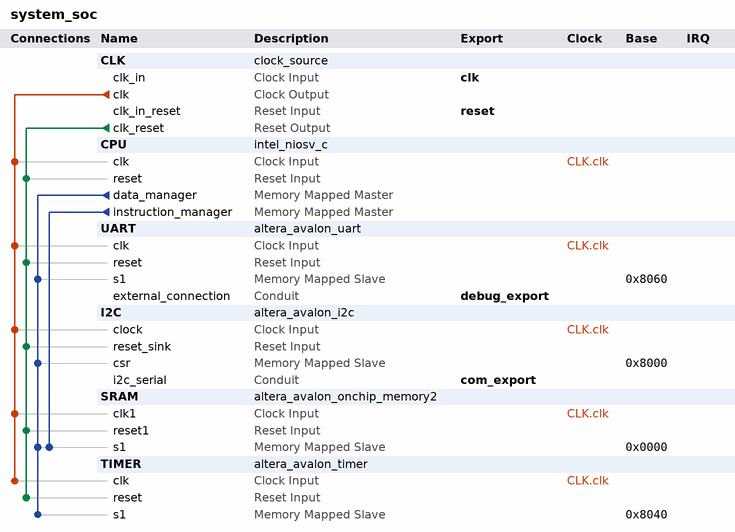
[diagram p0: system contents]
# Platform Designer (Qsys) system system_soc, Cyclone IV E EP4CE10E22C8
# Parameters at their usual value, and those the tool derives, are not listed.
package require -exact qsys 25.1
create_system system_soc
set_project_property DEVICE_FAMILY {Cyclone IV E}
set_project_property DEVICE EP4CE10E22C8

add_instance CLK clock_source 25.1
set_instance_parameter_value CLK clockFrequency 50000000

add_instance CPU intel_niosv_c 4.1.0
set_instance_parameter_value CPU archSize 32
set_instance_parameter_value CPU clockFrequency 50000000
set_instance_parameter_value CPU enableAvalonInterface false
set_instance_parameter_value CPU enableECCLite false
set_instance_parameter_value CPU enableResetReq false
set_instance_parameter_value CPU hartID 0
set_instance_parameter_value CPU numGpr 32
set_instance_parameter_value CPU resetOffset 0
set_instance_parameter_value CPU resetSlave SRAM.s1
set_instance_parameter_value CPU useResetReq false

add_instance UART altera_avalon_uart 25.1
set_instance_parameter_value UART baud 115200
set_instance_parameter_value UART dataBits 8
set_instance_parameter_value UART fixedBaud true
set_instance_parameter_value UART parity NONE
set_instance_parameter_value UART stopBits 1

add_instance I2C altera_avalon_i2c 25.1
set_instance_parameter_value I2C FIFO_DEPTH 32

add_instance SRAM altera_avalon_onchip_memory2 25.1
set_instance_parameter_value SRAM dataWidth 32
set_instance_parameter_value SRAM dualPort false
set_instance_parameter_value SRAM initMemContent true
set_instance_parameter_value SRAM initializationFileName /home/guilledev/Documents/Win/FPGA/EP4CE6E22C8N/Projects/Mock_LCD_1602_TEMP_HUM/sw/build/SRAM.hex
set_instance_parameter_value SRAM memorySize 32768
set_instance_parameter_value SRAM useNonDefaultInitFile true

add_instance TIMER altera_avalon_timer 25.1
set_instance_parameter_value TIMER period 1
set_instance_parameter_value TIMER periodUnits MSEC

# connections
add_connection CLK.clk CPU.clk clock
add_connection CLK.clk I2C.clock clock
add_connection CLK.clk SRAM.clk1 clock
add_connection CLK.clk TIMER.clk clock
add_connection CLK.clk UART.clk clock
add_connection CLK.clk_reset CPU.reset reset
add_connection CLK.clk_reset I2C.reset_sink reset
add_connection CLK.clk_reset SRAM.reset1 reset
add_connection CLK.clk_reset TIMER.reset reset
add_connection CLK.clk_reset UART.reset reset
add_connection CPU.data_manager I2C.csr avalon
set_connection_parameter_value CPU.data_manager/I2C.csr baseAddress 0x8000
add_connection CPU.data_manager SRAM.s1 avalon
set_connection_parameter_value CPU.data_manager/SRAM.s1 baseAddress 0x0000
add_connection CPU.data_manager TIMER.s1 avalon
set_connection_parameter_value CPU.data_manager/TIMER.s1 baseAddress 0x8040
add_connection CPU.data_manager UART.s1 avalon
set_connection_parameter_value CPU.data_manager/UART.s1 baseAddress 0x8060
add_connection CPU.instruction_manager SRAM.s1 avalon
set_connection_parameter_value CPU.instruction_manager/SRAM.s1 baseAddress 0x0000

# exported interfaces
add_interface clk clock sink
set_interface_property clk EXPORT_OF CLK.clk_in
add_interface com_export conduit end
set_interface_property com_export EXPORT_OF I2C.i2c_serial
add_interface debug_export conduit end
set_interface_property debug_export EXPORT_OF UART.external_connection
add_interface reset reset sink
set_interface_property reset EXPORT_OF CLK.clk_in_reset

set_interconnect_requirement {$system} qsys_mm.clockCrossingAdapter HANDSHAKE
set_interconnect_requirement {$system} qsys_mm.enableEccProtection FALSE
set_interconnect_requirement {$system} qsys_mm.insertDefaultSlave FALSE
set_interconnect_requirement {$system} qsys_mm.maxAdditionalLatency 1

save_system system_soc.qsys
